# EAGLE design Notification area (EAGLE 7.3.0)
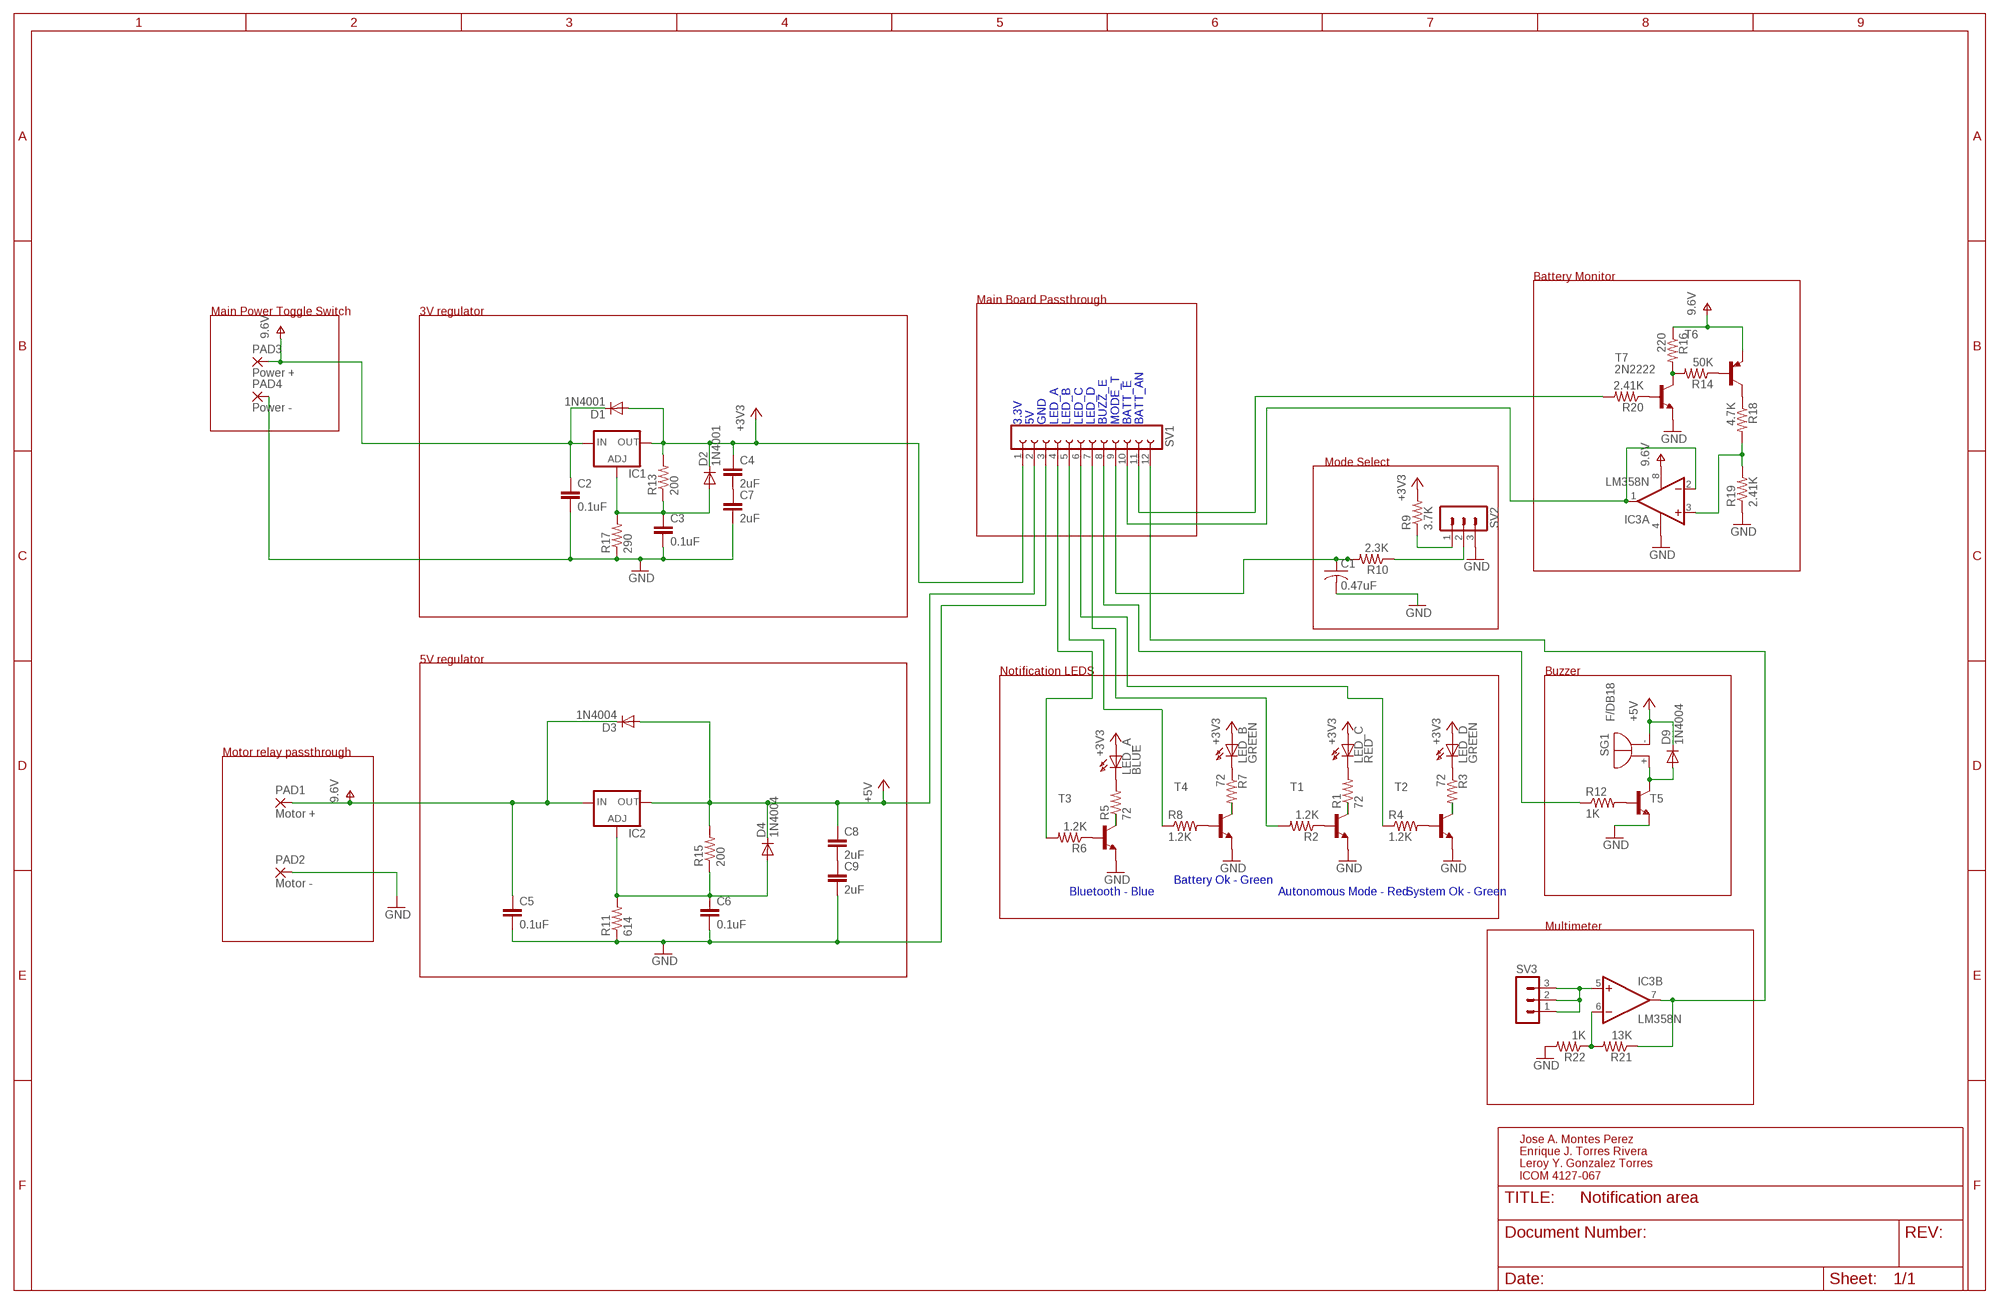
[diagram p0: schematic, sheet 1]

## Parts
C1  0.47uF  C-US025-030X050  [C025-030X050]
C2  0.1uF  C2,5-3  [C2.5-3]
C3  0.1uF  C2,5-3  [C2.5-3]
C4  2uF  C2,5-3  [C2.5-3]
C5  0.1uF  C2,5-3  [C2.5-3]
C6  0.1uF  C2,5-3  [C2.5-3]
C7  2uF  C2,5-3  [C2.5-3]
C8  2uF  C2,5-3  [C2.5-3]
C9  2uF  C2,5-3  [C2.5-3]
D1  1N4001  1N4004  [DO41-10]
D2  1N4001  1N4004  [DO41-10]
D3  1N4004  [DO41-10]
D4  1N4004  [DO41-10]
D9  1N4004  [DO41-10]
IC1  LM317TS  [317TS]
IC2  LM317TS  [317TS]
IC3  LM358N  [DIL08]
LED_A  BLUE  HLMP6  [HLMP6]
LED_B  GREEN  HLMP6  [HLMP6]
LED_C  RED  HLMP6  [HLMP6]
LED_D  GREEN  HLMP6  [HLMP6]
PAD1  Motor +  WIREPADSMD5-2,5  [5-2,5]
PAD2  Motor -  WIREPADSMD5-2,5  [5-2,5]
PAD3  Power +  WIREPADSMD5-2,5  [5-2,5]
PAD4  Power -  WIREPADSMD5-2,5  [5-2,5]
R1  72  R-US_0204/7  [0204/7]
R2  1.2K  R-US_0204/7  [0204/7]
R3  72  R-US_0204/7  [0204/7]
R4  1.2K  R-US_0204/7  [0204/7]
R5  72  R-US_0204/7  [0204/7]
R6  1.2K  R-US_0204/7  [0204/7]
R7  72  R-US_0204/7  [0204/7]
R8  1.2K  R-US_0204/7  [0204/7]
R9  3.7K  R-US_0204/7  [0204/7]
R10  2.3K  R-US_0204/7  [0204/7]
R11  614  R-US_0204/7  [0204/7]
R12  1K  R-US_0207/7  [0207/7]
R13  200  R-US_0204/7  [0204/7]
R14  50K  R-US_0204/7  [0204/7]
R15  200  R-US_0204/7  [0204/7]
R16  220  R-US_0204/7  [0204/7]
R17  290  R-US_0204/7  [0204/7]
R18  4.7K  R-US_0204/7  [0204/7]
R19  2.41K  R-US_0204/7  [0204/7]
R20  2.41K  R-US_0204/7  [0204/7]
R21  13K  R-US_0204/7  [0204/7]
R22  1K  R-US_0204/7  [0204/7]
SG1  F/DB18  [F/DB18]
SV1  FE12-1  [FE12]
SV2  MA03-1  [MA03-1]
SV3  MA03-1  [MA03-1]
T1  2N2222-NPN-TO92-EBC  [TO92-EBC]
T2  2N2222-NPN-TO92-EBC  [TO92-EBC]
T3  2N2222-NPN-TO92-EBC  [TO92-EBC]
T4  2N2222-NPN-TO92-EBC  [TO92-EBC]
T5  2N2222-NPN-TO92-EBC  [TO92-EBC]
T6  2N3906-PNP-TO92-EBC  [TO92-EBC]
T7  2N2222  [TO18]

## Nets
+3V3: C4.1 D1.A D2.C IC1.2(OUT) LED_A.A LED_B.A LED_C.A LED_D.A R9.2 R13.2 SV1.1
+5V: C8.1 D3.A D4.C D9.C IC2.2(OUT) R15.2 SG1.- SV1.2
GND: C1.2 C2.2 C3.2 C5.2 C6.2 C7.2 C9.2 IC3.4(P:V-) PAD2.1(P) PAD4.1(P) R11.1 R17.1 R19.1 R22.2 SV1.3 SV2.3 T1.E T2.E T3.E T4.E T5.E T7.1(E)
N$1: LED_C.K R1.2
N$2: R2.1 T1.B
N$3: LED_D.K R3.1
N$4: R4.2 T2.B
N$5: LED_A.K R5.2
N$6: R6.1 T3.B
N$7: LED_B.K R7.1
N$8: R8.2 T4.B
N$9: R6.2 SV1.4
N$10: C1.1 R10.2 SV1.9
N$11: R8.1 SV1.5
N$12: R4.1 SV1.6
N$13: R9.1 SV2.1
N$14: R5.1 T3.C
N$16: R12.2 T5.B
N$17: C4.2 C7.1
N$18: R2.2 SV1.7
N$19: C3.1 D2.A IC1.1(ADJ) R13.1 R17.2
N$20: C6.1 D4.A IC2.1(ADJ) R11.2 R15.1
N$21: D9.A SG1.+ T5.C
N$22: R14.1 T6.B
N$23: R14.2 R16.2 T7.3(C)
N$24: R12.1 SV1.8
N$25: R18.1 T6.C
N$26: R20.2 SV1.11
N$27: IC3.3(A:+IN) R18.2 R19.2
N$29: R20.1 T7.2(B)
N$30: C8.2 C9.1
N$31: R7.2 T4.C
N$32: R1.1 T1.C
N$33: R3.2 T2.C
N$34: R10.1 SV2.2
N$35: IC3.6(B:-IN) R21.2 R22.1
N$36: IC3.7(B:OUT) R21.1 SV1.12
N$37: IC3.5(B:+IN) SV3.1 SV3.2 SV3.3
N$39: IC3.1(A:OUT) IC3.2(A:-IN) SV1.10
V+: C2.1 C5.1 D1.C D3.C IC1.3(IN) IC2.3(IN) IC3.8(P:V+) PAD1.1(P) PAD3.1(P) R16.1 T6.E ; supply symbol labelled 9.6V

## Notes on the sheet
- Battery Monitor
- Main Board Passthrough
- Main Power Toggle Switch | 3V regulator
- 3.3V
  5V
  GND
  LED_A
  LED_B
  LED_C
  LED_D
  BUZZ_E
  MODE_T
  BATT_E
  BATT_AN
- Mode Select
- 5V regulator
- Notification LEDS | Buzzer
- Motor relay passthrough
- Battery Ok - Green
- Bluetooth - Blue | Autonomous Mode - Red | System Ok - Green
- Multimeter
- Jose A. Montes Perez
  Enrique J. Torres Rivera
  Leroy Y. Gonzalez Torres
  ICOM 4127-067

## Library data of the parts
C1 = rcl:C-US: CAPACITOR, American symbol
C2-C9 = capacitor-wima:C: CAPACITOR naming: grid - package width
D1-D4 D9 = diode:1N4004: DIODE general purpose rectifier, 1 A
IC1 IC2 = v-reg:LM317TS: VOLTAGE REGULATOR
IC3 = linear:LM358: OP AMP also LM158; LM258; LM2904 Source: http://cache.national.com/ds/LM/LM158.pdf
LED_A LED_B LED_C LED_D = display-hp:HLMP6: LED 2mm horizontal; MF: AGILENT TECHNOLOGIES; MPN: HLMP-6500; OC_FARNELL: 1652490; OC_NEWARK: 40K0088
PAD1-PAD4 = wirepad:WIREPAD: Wire PAD connect wire on PCB
R1-R22 = rcl:R-US_: RESISTOR, American symbol
SG1 = buzzer:F/DB18: BUZZER Source: Buerklin; OC_FARNELL: unknown; OC_NEWARK: unknown
SV1 = con-lsta:FE12-1: FEMALE HEADER; OC_FARNELL: unknown; OC_NEWARK: unknown
SV2 SV3 = con-lstb:MA03-1: PIN HEADER; OC_FARNELL: unknown; OC_NEWARK: unknown
T1-T5 = transistor-neu-to92:*-NPN-: NPN Transistror
T6 = transistor-neu-to92:*-PNP-: PNP Transistror
T7 = transistor-neu-to92:2N2222: NPN TRANSISTOR

## Board
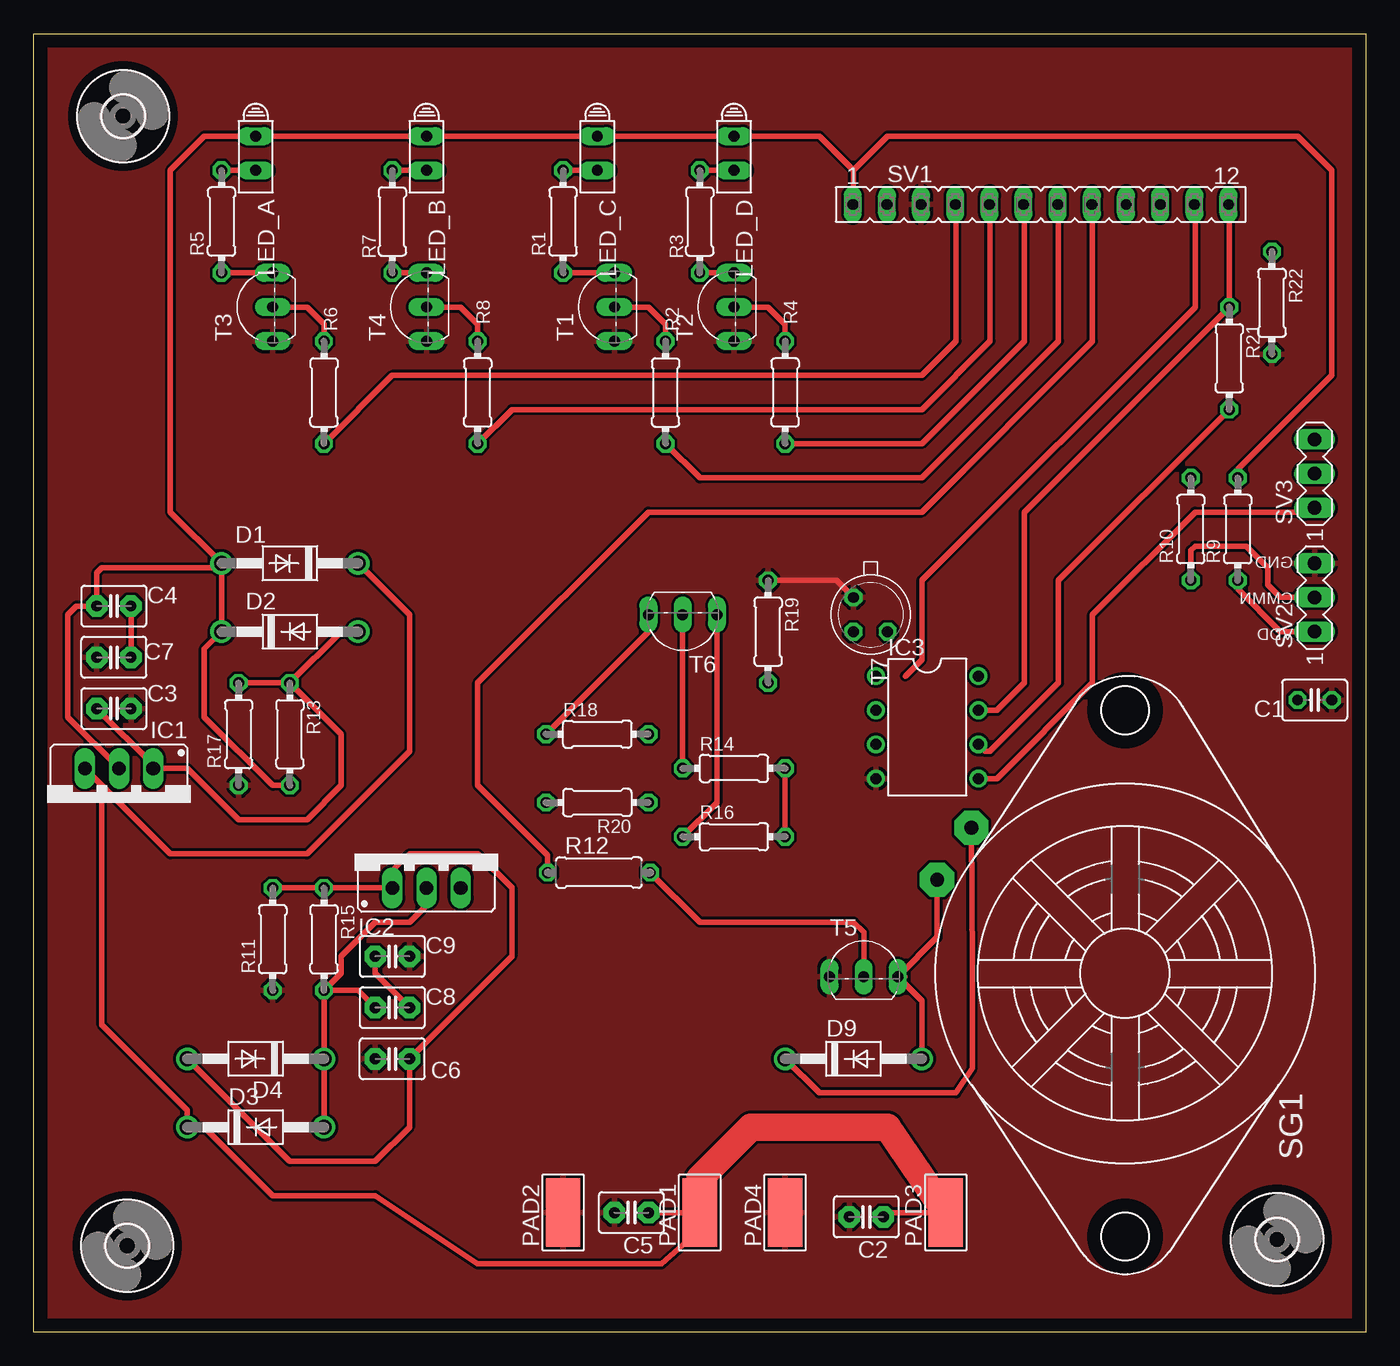
[diagram p1: board, top side]
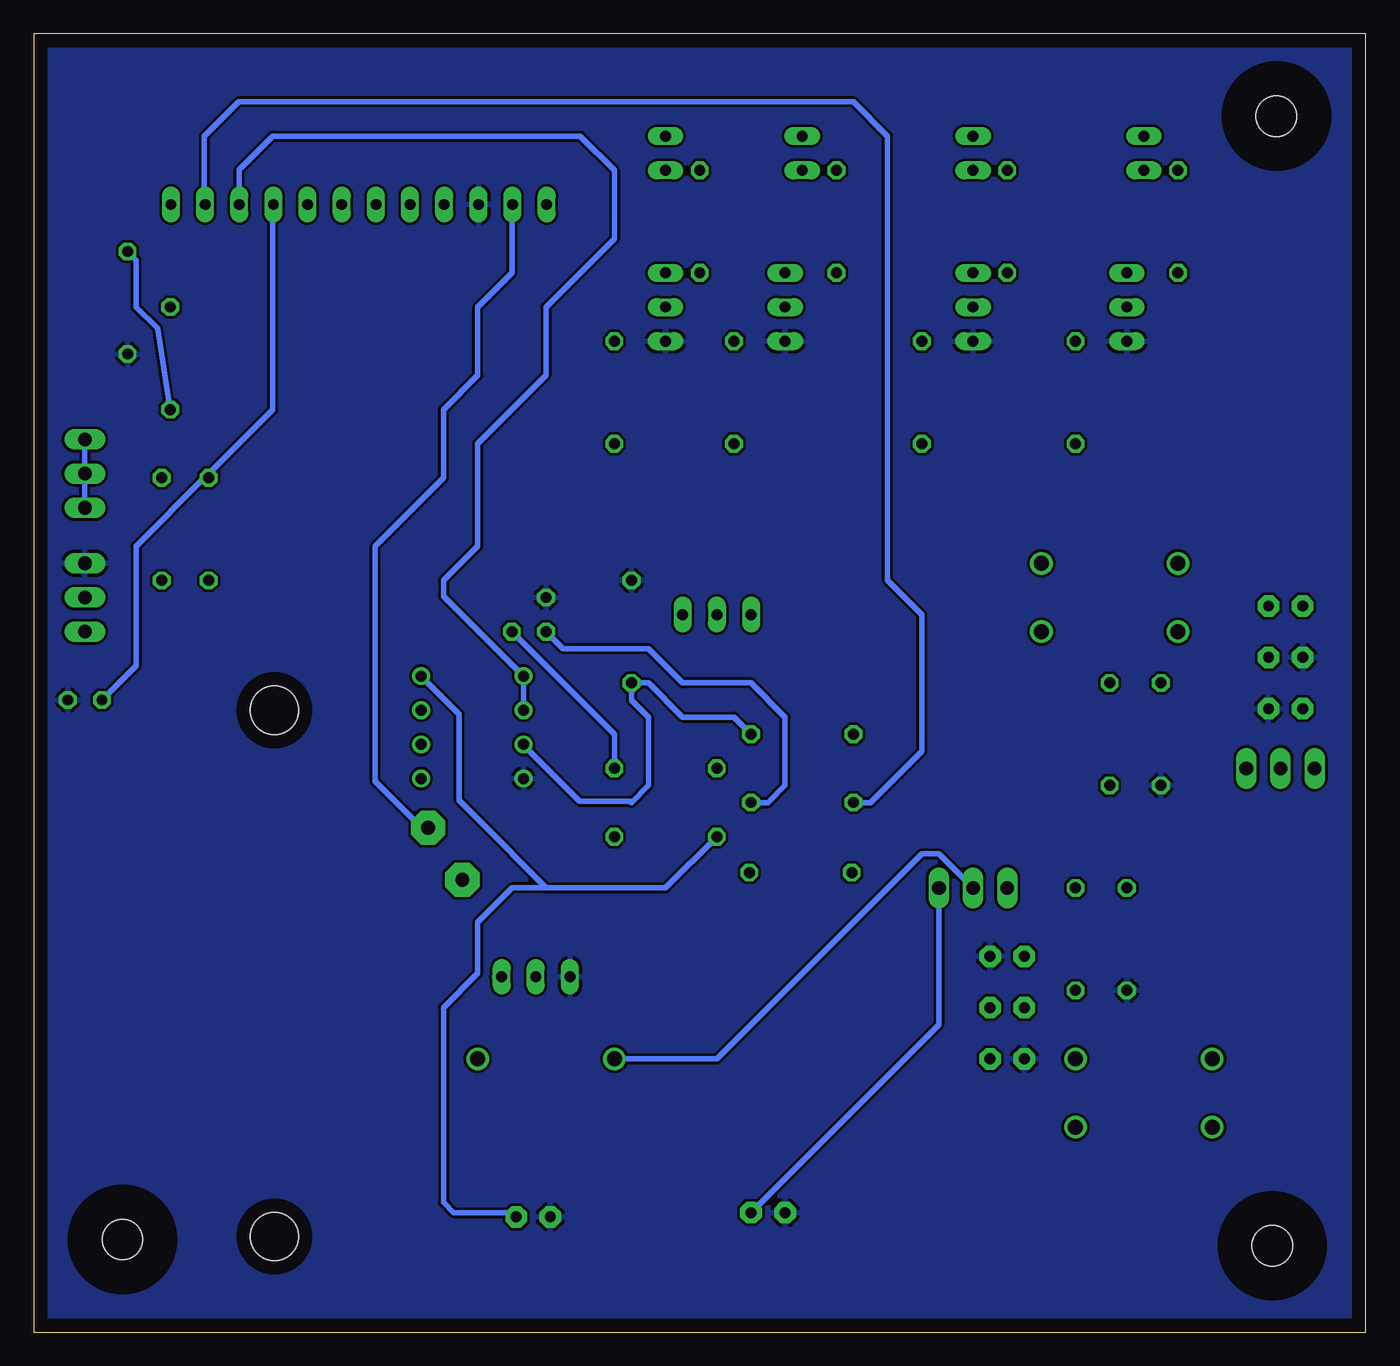
[diagram p2: board, bottom side, seen from below]

Size 99.06 x 96.52 mm. Coordinates in mm from the lower left corner, seen from the top.
Outline: 0,0 0,96.52 99.06,96.52 99.06,0 0,0
Copper layers (1*16): Top 0.035mm / dielectric 1.5mm / Bottom 0.035mm
Design rules "default": minimum track width 10mil, minimum drill 24mil, track to track 8mil, track to pad 8mil, pad to pad 8mil, via to via 8mil, smd to smd 8mil, copper to edge 40mil, drill to drill 8mil, minimum pad ring 10mil, minimum via ring 8mil, stop-mask expansion 4mil, vias tented up to drill 0mil, thermal gap 10mil

### Footprints (pad centres in the part's own frame; a part is rotated, then mirrored left to right if it is on the bottom)
C025-030X050 = drill 0.813 octagon: 1 -1.27,0; 2 1.27,0
C2.5-3 = drill 0.813 pad 1.6 octagon: 1 -1.27,0; 2 1.27,0
DO41-10 = drill 1.118: A 5.08,0; C -5.08,0
317TS = drill 1.016 long: 1 -2.54,-2.54; 2 0,-2.54; 3 2.54,-2.54
DIL08 = drill 0.813 pad 1.27: 1 -3.81,-3.81; 2 -1.27,-3.81; 3 1.27,-3.81; 4 3.81,-3.81; 5 3.81,3.81; 6 1.27,3.81; 7 -1.27,3.81; 8 -3.81,3.81
HLMP6 = drill 0.813 long: A -1.27,0; K 1.27,0
5-2,5 = smd 2.54 x 5.08: 1 0,0
0204/7 = drill 0.813 octagon: 1 -3.81,0; 2 3.81,0
0207/7 = drill 0.813 octagon: 1 -3.81,0; 2 3.81,0
F/DB18 = drill 1.016 pad 2.54 octagon: + -6.96,-13.97; - -10.82,-11.43 | hole 3.607: 19.558,0; -19.558,0
FE12 = drill 0.813 long: 1 -13.97,0; 2 -11.43,0; 3 -8.89,0; 4 -6.35,0; 5 -3.81,0; 6 -1.27,0; 7 1.27,0; 8 3.81,0; 9 6.35,0; 10 8.89,0; 11 11.43,0; 12 13.97,0
MA03-1 = drill 1.016 long: 1 -2.54,0; 2 0,0; 3 2.54,0
TO92-EBC = drill 0.813 long: B 0,-1.27; C 2.54,-1.27; E -2.54,-1.27
TO18 = drill 0.813 octagon: 1 -1.27,-1.27; 2 1.27,-1.27; 3 1.27,1.27
3,0 = hole 3: 0,0

### Placement (x,y rotation side)
C1  95.25,46.99 0 top
C2  61.91,8.57 180 top
C3  5.97,46.35 0 top
C4  5.97,53.98 0 top
C5  44.45,8.89 180 top
C6  26.67,20.32 180 top
C7  5.97,50.16 180 top
C8  26.67,24.13 0 top
C9  26.67,27.94 0 top
D1  19.05,57.15 180 top
D2  19.05,52.07 0 top
D3  16.51,15.24 0 top
D4  16.51,20.32 180 top
D9  60.96,20.32 0 top
IC1  6.35,39.37 180 top
IC2  29.21,35.56 0 top
IC3  66.45,44.96 270 top
LED_A  16.51,87.63 270 top
LED_B  29.21,87.63 270 top
LED_C  41.91,87.63 270 top
LED_D  52.07,87.63 270 top
PAD1  49.53,8.89 0 top
PAD2  39.37,8.89 0 top
PAD3  67.82,8.89 0 top
PAD4  55.88,8.89 0 top
R1  39.37,82.55 90 top
R2  46.99,69.85 270 top
R3  49.53,82.55 270 top
R4  55.88,69.85 90 top
R5  13.97,82.55 90 top
R6  21.59,69.85 270 top
R7  26.67,82.55 270 top
R8  33.02,69.85 90 top
R9  89.53,59.69 90 top
R10  86.04,59.69 90 top
R11  17.78,29.21 90 top
R12  42.04,34.16 0 top
R13  19.05,44.45 270 top
R14  52.07,41.91 0 top
R15  21.59,29.21 270 top
R16  52.07,36.83 0 top
R17  15.24,44.45 90 top
R18  41.91,44.45 0 top
R19  54.61,52.07 270 top
R20  41.91,39.37 180 top
R21  88.9,72.39 270 top
R22  92.07,76.52 270 top
SG1  81.15,26.67 270 top
SV1  74.88,83.82 0 top
SV2  95.25,54.61 90 top
SV3  95.25,63.82 90 top
T1  41.91,76.2 90 top
T2  50.8,76.2 90 top
T3  16.51,76.2 90 top
T4  27.94,76.2 90 top
T5  61.72,27.69 0 top
T6  48.26,52.07 180 top
T7  62.23,53.34 270 top
U$1  [3,0]  6.96,6.43 0 top
U$2  [3,0]  6.65,90.39 0 top
U$4  [3,0]  92.46,6.88 0 top

### Tracks (layer width: path | path; a pad name or v marks a point on that pad's centre or on a via)
+3V3
  Top 0.406: SV1.1 60.96,86.36 | 60.96,86.36 58.42,88.9 LED_D.A LED_C.A LED_B.A | 27.94,88.9 LED_B.A | LED_B.A LED_A.A 12.7,88.9 10.16,86.36 10.16,60.96 D1.A | D1.A D2.C 12.7,50.8 12.7,45.72 17.78,40.64 R13.2 | D1.A 13.65,56.83 5.08,56.83 4.7,56.45 C4.1 3.17,53.98 2.54,53.34 2.54,45.72 IC1.2 | R9.2 89.53,64.14 96.52,71.12 96.52,86.36 93.98,88.9 63.5,88.9 60.96,86.36
+5V
  Top 0.406: D3.A D4.C R15.2 | R15.2 24.13,25.4 C8.1 | IC2.2 29.21,31.75 27.94,30.48 25.4,30.48 22.86,27.94 22.86,26.67 R15.2 | D9.C 58.42,17.78 68.58,17.78 69.79,19.62 69.79,27.27 SG1.-
  Bottom 0.406: D9.C 48.26,20.32 33.02,35.56 31.75,35.56 IC2.2 | SG1.- 70.21,37.49 73.66,40.95 73.66,58.42 68.58,63.5 68.58,68.58 66.04,71.12 66.04,76.2 63.5,78.74 63.5,83.77 SV1.2
GND
  Top 0.406: R19.1 59.69,55.88 T7.1
  pour Bottom: 0,96.52 99.06,96.52 99.06,0 0,0
  pour Top: 0,96.52 99.06,96.52 99.06,0 0,0
N$1
  Top 0.406: LED_C.K R1.2
N$2
  Top 0.406: R2.1 46.99,74.93 45.72,76.2 T1.B
N$3
  Top 0.406: LED_D.K R3.1
N$4
  Top 0.406: R4.2 55.88,74.93 54.61,76.2 T2.B
N$5
  Top 0.406: LED_A.K R5.2
N$6
  Top 0.406: T3.B 20.32,76.2 21.59,74.93 R6.1
N$7
  Top 0.406: LED_B.K R7.1
N$8
  Top 0.406: T4.B 31.75,76.2 33.02,74.93 R8.2
N$9
  Top 0.406: R6.2 26.67,71.12 66.04,71.12 68.58,73.66 68.58,82.6 SV1.4
N$10
  Bottom 0.406: SV1.9 81.28,82.6 81.28,68.58 86.04,63.82 R10.2 86.36,63.5 91.44,58.42 91.44,49.53 C1.1
N$11
  Top 0.406: R8.1 35.56,68.58 66.04,68.58 71.12,73.66 71.12,82.6 SV1.5
N$12
  Top 0.406: R4.1 66.04,66.04 73.66,73.66 73.66,82.6 SV1.6
N$13
  Top 0.406: R9.1 89.53,55.24 92.71,52.07 SV2.1
N$14
  Top 0.406: R5.1 T3.C
N$16
  Top 0.406: T5.B 61.72,29.72 60.96,30.48 49.53,30.48 R12.2
N$17
  Top 0.406: C4.2 C7.1
N$18
  Top 0.406: R2.2 49.53,63.5 66.04,63.5 76.2,73.66 76.2,82.6 SV1.7
N$19
  Top 0.406: D2.A 22.86,52.07 R13.1 | R13.1 R17.2 | C3.1 8.89,42.16 IC1.1 11.43,41.91 15.24,38.1 20.32,38.1 22.86,40.64 22.86,44.45 R13.1
N$20
  Top 0.406: D4.A 19.05,12.7 25.4,12.7 27.94,15.24 C6.1 35.56,27.94 35.56,33.02 33.02,35.56 27.94,35.56 26.67,34.29 IC2.1 R15.1 R11.2
N$21
  Top 0.406: D9.A 66.04,24.64 T5.C | 64.79,26.42 T5.C | SG1.+ 67.18,29.34 T5.C
  Bottom 0.406: T5.C 64.79,26.42
N$22
  Top 0.406: T6.B R14.1
N$23
  Top 0.406: R16.2 R14.2
  Bottom 0.406: R14.2 55.88,44.45 T7.3
N$24
  Top 0.406: R12.1 38.23,35.43 33.02,40.64 33.02,48.26 45.72,60.96 66.04,60.96 78.74,73.66 78.74,82.6 SV1.8
N$25
  Top 0.406: T6.C 45.72,52.07 R18.1
N$26
  Top 0.406: 64.82,48.77 66.04,49.99 66.04,55.88 86.36,76.2 86.36,82.6 SV1.11
  Bottom 0.406: R20.2 36.83,39.37 33.02,43.18 33.02,53.34 35.56,55.88 35.56,88.9 38.1,91.44 83.82,91.44 86.36,88.9 86.36,83.87 SV1.11
N$27
  Bottom 0.406: R18.2 46.99,45.72 50.8,45.72 53.34,48.26 R19.2 54.61,46.99 53.34,45.72 53.34,40.64 54.61,39.37 54.71,39.47 58.47,39.47 62.64,43.64 IC3.3
N$29
  Bottom 0.406: R20.1 44.45,39.37 43.18,40.64 43.18,45.72 45.72,48.26 50.8,48.26 53.34,50.8 59.69,50.8 T7.2
N$30
  Top 0.406: C9.1 25.4,26.67 C8.2
N$31
  Top 0.406: R7.2 T4.C
N$32
  Top 0.406: T1.C R1.1
N$33
  Top 0.406: R3.2 T2.C
N$34
  Top 0.406: R10.1 86.04,58.1 86.36,58.42 90.17,58.42 91.76,56.83 91.76,55.56 92.71,54.61 SV2.2
N$35
  Top 0.406: R21.2 76.2,55.88 76.2,48.26 71.12,43.18 70.76,43.18 IC3.6
  Bottom 0.406: R21.2 89.85,74.61 91.44,76.2 91.44,79.69 R22.1
N$36
  Top 0.406: SV1.12 88.9,83.82 R21.1 73.66,60.96 73.66,48.26 71.63,46.23 IC3.7
N$37
  Top 0.406: IC3.5 71.63,41.15 78.74,48.26 78.74,53.34 86.36,60.96 94.93,60.96 SV3.1
  Bottom 0.406: SV3.1 SV3.2 SV3.3
N$39
  Bottom 0.406: SV1.10 83.77,86.41 81.28,88.9 58.42,88.9 55.88,86.36 55.88,81.28 60.96,76.2 60.96,71.12 66.04,66.04 66.04,58.42 68.58,55.88 68.58,54.71 IC3.1 IC3.2
V+
  Top 0.406: C5.1 PAD1.1 | 49.53,7.62 46.67,5.08 33.02,5.08 25.4,10.16 17.78,10.16 12.7,15.24 D3.C 11.43,16.51 5.08,22.86 5.08,40.64 IC1.3 10.16,35.56 20.32,35.56 27.94,43.18 27.94,53.34 D1.C | T6.E 50.8,39.37 R16.1 | PAD3.1 63.5,8.89 C2.1
  Top 2.032: PAD3.1 63.5,15.24 53.34,15.24 49.53,11.43 PAD1.1 49.53,7.62
  Bottom 0.406: IC2.3 31.75,22.86 C5.1 | 60.96,33.02 63.5,35.56 63.5,35.61 67.41,39.52 67.41,45.92 IC3.8 | 60.96,33.02 52.07,33.02 R16.1 | 60.96,33.02 63.5,33.02 66.04,30.48 66.04,26.67 68.58,24.13 68.58,9.65 PAD3.1 63.5,8.89 C2.1

### Text on the board
tNames: GND / / CMMN / / VDD
200bmp: Jose A. Montes Perez / Enrique J. Torres Rivera / Leroy Y. Gonzalez Torres / ICOM 4217